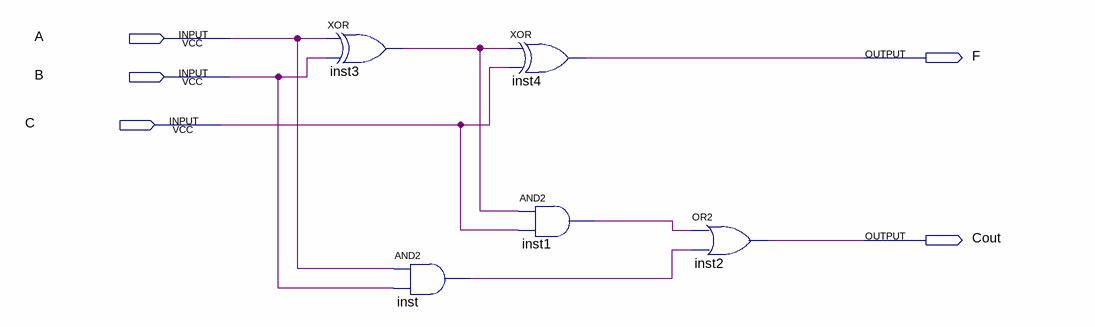
[diagram p0: schematic sheet]
// Quartus schematic fulladder.bdf as structural Verilog: 5 symbols, 5 pins
module fulladder (
  input  A,
  input  B,
  input  C,
  output F,
  output Cout
);

  wire inst1_out, inst3_out, inst_out;

  xor inst3 (inst3_out, A, B);
  and inst (inst_out, A, B);
  xor inst4 (F, inst3_out, C);
  and inst1 (inst1_out, inst3_out, C);
  or inst2 (Cout, inst1_out, inst_out);
endmodule
